# Altium project ACS711_ADC121_test.PrjPcb
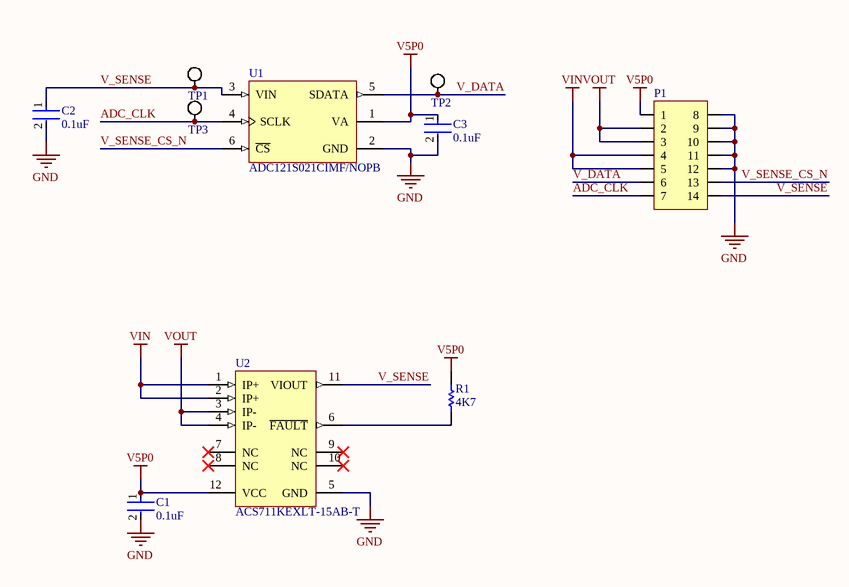
[diagram p0: CurrentSenseTest_SCH.SchDoc]
1 sheet, 10 parts. Net scope: global (net labels, ports and power ports of the same name join across sheets).
Board file: CurrentSenseTest_PCB.PcbDoc

## Sheet CurrentSenseTest_SCH.SchDoc
size A; SheetNumber: 1; SheetTotal: 1

### Parts
C1  0.1uF  [0603]
C2  0.1uF  [0603]
C3  0.1uF  [0603]
P1  14-Pin 2-Row Nano-Fit Right Angle  [MOLEX NANO-FIT 2X7 - Right Angle]  (value not drawn)
R1  4K7  [0603]
TP1  Test Point Pad  [Test Point Pad]  (value not drawn)
TP2  Test Point Pad  [Test Point Pad]  (value not drawn)
TP3  Test Point Pad  [Test Point Pad]  (value not drawn)
U1  ADC121S021CIMF/NOPB  [MF06A_L]
U2  ACS711KEXLT-15AB-T  [ALEG-EX-12_V]

### Nets
GND: C1.2 C2.2 C3.2 P1.8 P1.9 P1.10 P1.11 P1.12 U1.2(GND) U2.5(GND)
V5P0: C1.1 C3.1 P1.1 R1.1 U1.1(VA) U2.12(VCC)
VIN: P1.4 P1.5 U2.1(IP+) U2.2(IP+)
VOUT: P1.2 P1.3 U2.3(IP-) U2.4(IP-)
ADC_CLK: P1.7 TP3.1 U1.4(SCLK)
V_DATA: P1.6 TP2.1 U1.5(SDATA)
V_SENSE: C2.1 P1.14 TP1.1 U1.3(VIN) U2.11(VIOUT)
V_SENSE_CS_N: P1.13 U1.6(~{CS})
NetR1_2: R1.2 U2.6(~{FAULT})

Not connected (* = marked no-connect by the designer): U2 7(NC)* 8(NC)* 9(NC)* 10(NC)*

### Library data of the parts
C1-C3 = 0.1uF 0603: CC0603KRX7R9BB104-CAP CER 0.1UF 50V X7R 0603; Manufacturer: YAGEO; Material: Ceramic; Capacitance: 100 nF; Temperature Coefficient: 15%; Tolerance: 0.1; Value: 100 nF; Height: 0.9mm; Voltage: 50 V; ComponentLink2Description: Datasheet; Device Class L2: Capacitors; Temperature Range High: +125°C; Category: Cap; Footprint Url: http://www.yageo.com/exep/pages/download/literatures/UPY-C_GEN_24.pdf; ComponentLink2URL: http://www.yageo.com/documents/recent/UPY-GPHC_X7R_6.3V-to-50V_18.pdf; Package: CC0603-DA; Temperature: -55°C to +125°C; Voltage Rating: 50 V; Temperature Characteristic: X7R; Device Class L1: Passive Components; Temperature Range Low: -55°C; Manufacturer Part Number: CC0603KRX7R9BB104; RoHS: TRUE; Automotive: No; Device Class L3: Ceramic Capacitors; Octopart: https://octopart.com/cc0603krx7r9bb104-yageo-42244635; Mouser Description: Multilayer Ceramic Capacitor, CC Series, 0.1 - F, - 10%, X7R, 50 V, 0603 [1608 Metric]; Lead Free: Yes; Digikey Description: CAP CER 0.1UF 50V X7R 0603; ComponentLink3Description: Link; ComponentLink3URL: https://www.digikey.com/en/products/detail/samsung-electro-mechanics/CL10B104KB8NNWC/3887593
P1 = 14-Pin 2-Row Nano-Fit Right Angle: NanoFit Right Hdr TH DR 14Ckt; Part Number: 105314-1214; Manufacturer: Molex; Supplier: Mouser; Supplier Part Number: 538-105314-1214; Supplier 1: Mouser; Supplier Part Number 1: 538-105314-1214; ComponentLink1Description: Mouser Link; ComponentLink1URL: https://www.mouser.com/ProductDetail/Molex/105314-1214?qs=PqFvFmEiOr6wLIXpvlvqbA%3D%3D; ComponentLink2Description: Link; ComponentLink2URL: https://www.digikey.com/en/products/detail/molex/1053141114/7693193
R1 = 4K7 0603: 4K7 0.1W 1% 0603 (1608 Metric)  SMD; Case-Metric: 1608; Value: 4700.00 Ohm; Case-EIA: 0603; Power: 0.1 W; Tolerance: 1 %; Technology: SMT; ComponentLink1Description: Link; ComponentLink1URL: https://www.digikey.com/en/products/detail/yageo/RC0603FR-074K7L/727212
TP1-TP3 = Test Point Pad: Test point, Pad, 30 mil
U1 = CMP-0054-00265-2: Single Channel, 50 to 200 kSPS, 12-Bit A/D Converter, 6-pin SOT-23, Pb-Free; Manufacturer: National Semiconductor; PowerWise: Y; CompType: ADC IC; PackageTopMarking: X07C*XTT; ComponentLink2Description: ADC121S021 Web Page; PackageReference: MF06A; Code_IPC: SOT26A-6; PackageDescription: Molded SOT-23, .115 x .063 x .040in Body, 6 Lead, .0375in in Pitch; PackageVersion: revC, Sep-2005; Code_JEDEC: MO-178-AB; RevisionNote: Component URLs added; ComponentLink3Description: MF06A Package Page; PinCount: 6; ComponentLink3URL: http://www.national.com/packaging/folders/mf06a.html; ComponentLink1URL: http://www.national.com/ds/AD/ADC121S021.pdf; ComponentLink1Description: ADC121S021 Datasheet; DatasheetVersion: Jan-2010; ComponentLink2URL: http://www.national.com/pf/AD/ADC121S021.html; RoHS: Y
U2 = CMP-1557-00001-1: Hall Effect Linear Current Sensor with Overcurrent Fault Output for <100 V Isolation Applications, 3 to 5.5 V, -15.5 to 15.5 A IP, -40 to 125 degC, 12-Pin QFN (EX), RoHS, Tape and Reel; VCC Max: 5.5 V; IP Max: 15.5 A; VCC Min: 3 V; IP Min: -15.5 A; -3dB Bandwidth: 0.1 MHz; PackageDescription: 12-Pin Quad Flat No-Lead, Body 3 x 3 mm, Height 0.8 mm; ComponentLink1URL: http://www.allegromicro.com/; Packing: Tape and Reel; ComponentLink2URL: http://www.allegromicro.com/~/media/Files/Datasheets/ACS711-Datasheet.ashx?la=en; DatasheetVersion: Rev. 3; PartNumber: ACS711KEXLT-15AB-T; ComponentLink2Description: Datasheet; ComponentLink3URL: http://www.allegromicro.com/~/media/Files/Datasheets/ACS711-Datasheet.ashx?la=en; RoHS: TRUE; ComponentLink1Description: Manufacturer URL; ComponentLink3Description: Package Specification; Temperature Max: 125 degC; Mounting Technology: Surface Mount; Temperature Min: -40 degC